# EAGLE design gl-gps (EAGLE 6.4)
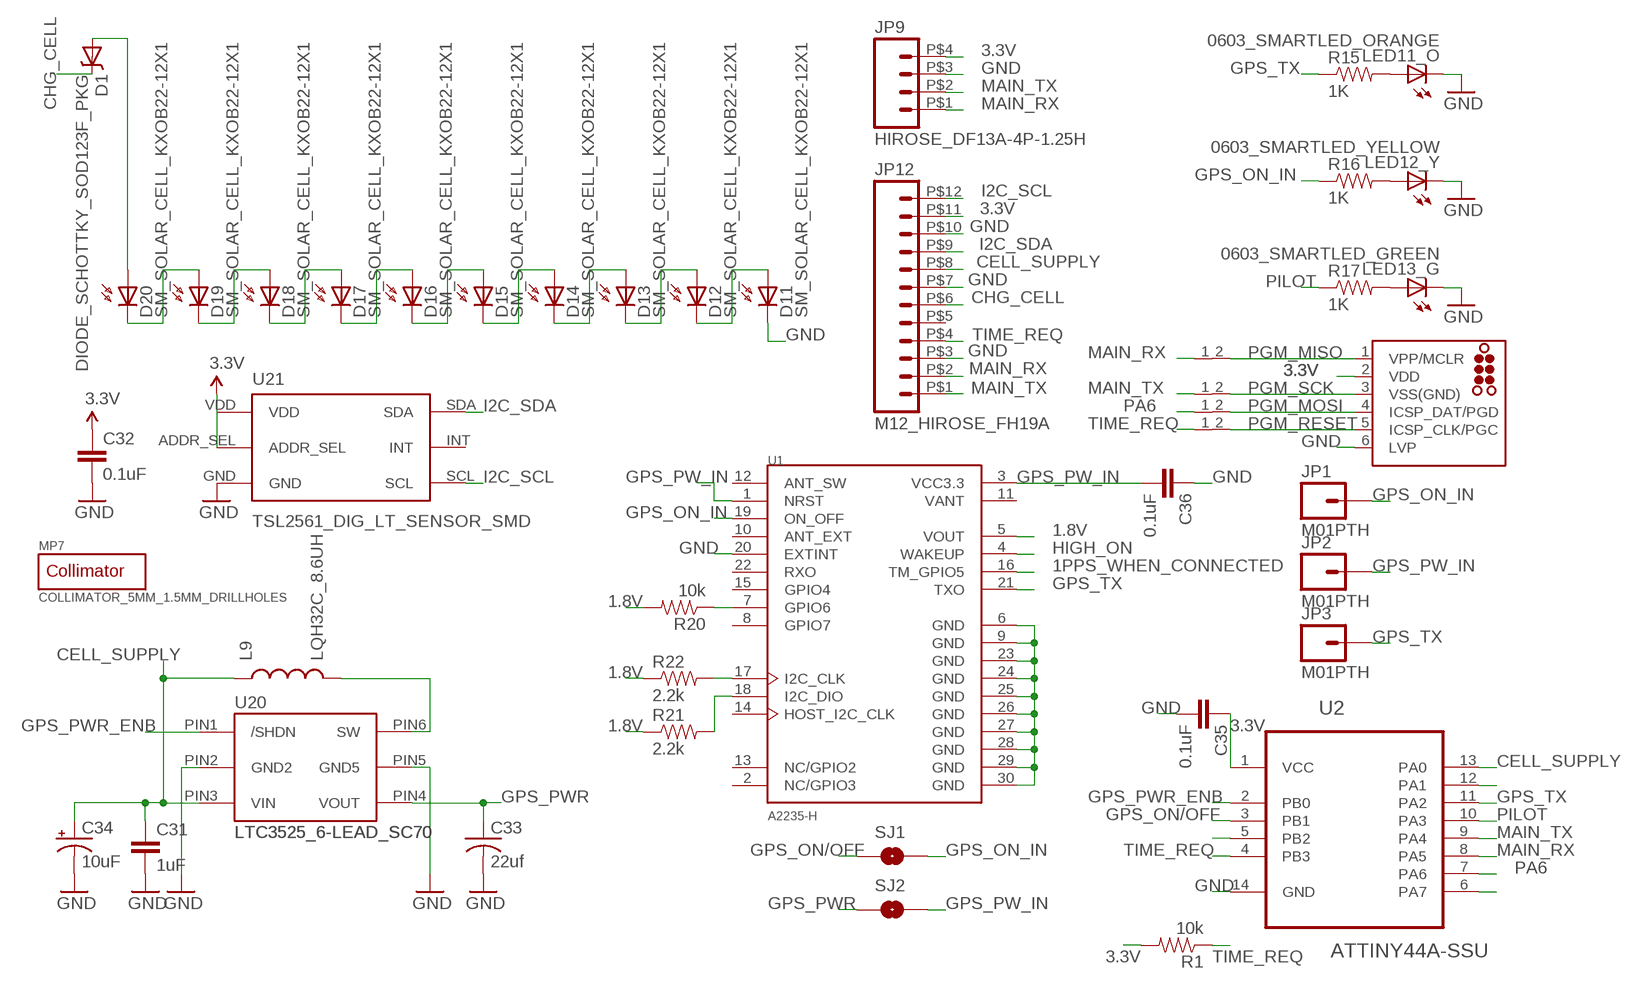
[diagram p0: schematic, sheet 1]

## Parts
C31  1uF  CAP0603-CAP  [0603-CAP]
C32  0.1uF  CAP0402-CAP  [0402-CAP]
C33  22uf  C-USC1210K  [C1210K]
C34  10uF  CAP_POL1206  [EIA3216]
C35  0.1uF  CAP0402-CAP  [0402-CAP]
C36  0.1uF  CAP0402-CAP  [0402-CAP]
D1  DIODE_SCHOTTKY_SOD123F_PKG  [SOD123F]
D11  SM_SOLAR_CELL_KXOB22-12X1  [SM_SOLAR_CELL_KXOB22-12X1]
D12  SM_SOLAR_CELL_KXOB22-12X1  [SM_SOLAR_CELL_KXOB22-12X1]
D13  SM_SOLAR_CELL_KXOB22-12X1  [SM_SOLAR_CELL_KXOB22-12X1]
D14  SM_SOLAR_CELL_KXOB22-12X1  [SM_SOLAR_CELL_KXOB22-12X1]
D15  SM_SOLAR_CELL_KXOB22-12X1  [SM_SOLAR_CELL_KXOB22-12X1]
D16  SM_SOLAR_CELL_KXOB22-12X1  [SM_SOLAR_CELL_KXOB22-12X1]
D17  SM_SOLAR_CELL_KXOB22-12X1  [SM_SOLAR_CELL_KXOB22-12X1]
D18  SM_SOLAR_CELL_KXOB22-12X1  [SM_SOLAR_CELL_KXOB22-12X1]
D19  SM_SOLAR_CELL_KXOB22-12X1  [SM_SOLAR_CELL_KXOB22-12X1]
D20  SM_SOLAR_CELL_KXOB22-12X1  [SM_SOLAR_CELL_KXOB22-12X1]
J1  TC2030-MCP-NL  [TC2030-MCP-NL]
JP1  M01PTH  [1X01]
JP2  M01PTH  [1X01]
JP3  M01PTH  [1X01]
JP9  HIROSE_DF13A-4P-1.25H  [HIROSE_DF13A-4P-1.25H]
JP12  M12_HIROSE_FH19A  [HIROSE_FH19_12POS]
L9  LQH32C_8.6UH  LQH32C  [1210_SIZE_INDUCTOR]
LED11_O  0603_SMARTLED_ORANGE  0603_SMARTLED  [0603_SMARTLED]
LED12_Y  0603_SMARTLED_YELLOW  0603_SMARTLED  [0603_SMARTLED]
LED13_G  0603_SMARTLED_GREEN  0603_SMARTLED  [0603_SMARTLED]
MP7  COLLIMATOR_5MM_1.5MM_DRILLHOLES  [COLLIMATOR_5MM_1.5MM_DRILLHOLES]
R1  10k  RESISTOR0402-RES  [0402-RES]
R15  1K  RESISTOR0402-RES  [0402-RES]
R16  1K  RESISTOR0402-RES  [0402-RES]
R17  1K  RESISTOR0402-RES  [0402-RES]
R20  10k  RESISTOR0402-RES  [0402-RES]
R21  2.2k  RESISTOR0402-RES  [0402-RES]
R22  2.2k  RESISTOR0402-RES  [0402-RES]
SJ1  SOLDERJUMPERTRACE  [SJ_2S-TRACE]
SJ2  SOLDERJUMPERTRACE  [SJ_2S-TRACE]
U1  A2235-H  [XCVR_A2235-H]
U2  ATTINY44A-SSU  [SOIC127P600X175-14N]
U20  LTC3525_6-LEAD_SC70  [SC70]
U21  TSL2561_DIG_LT_SENSOR_SMD  [6_PAD_FLAT_NO-LEAD]
U$2  SHORT_8MIL8MIL  [SHORT_8MIL]
U$3  SHORT_8MIL8MIL  [SHORT_8MIL]
U$4  SHORT_8MIL8MIL  [SHORT_8MIL]
U$5  SHORT_8MIL8MIL  [SHORT_8MIL]

## Nets
1.8V: R20.2 R21.1 R22.1 U1.5(VOUT)
1PPS_WHEN_CONNECTED: U1.16(TM_GPIO5)
3.3V: C32.1 C35.1 J1.2(VDD) JP9.P$4 JP12.P$11 R1.2 U2.1(VCC) U21.ADDR_SEL U21.VDD
CELL_SUPPLY: C31.1 C34.A(+) JP12.P$8 L9.P$1 U2.13(PA0) U20.PIN3(VIN)
CHG_CELL: D1.P$1(C) JP12.P$6
GND: C31.2 C32.2 C33.2 C34.C(-) C35.2 C36.1 D11.CATHODE(C) J1.6(LVP) JP9.P$3 JP12.P$3 JP12.P$7 JP12.P$10 LED11_O.P$1(C) LED12_Y.P$1(C) LED13_G.P$1(C) U1.6(GND) U1.9(GND) U1.20(EXTINT) U1.23(GND) U1.24(GND) U1.25(GND) U1.26(GND) U1.27(GND) U1.28(GND) U1.29(GND) U1.30(GND) U2.14(GND) U20.PIN2(GND2) U20.PIN5(GND5) U21.GND
GPS_ON/OFF: SJ1.1 U2.3(PB1)
GPS_ON_IN: JP1.1 R16.1 SJ1.2 U1.19(ON_OFF)
GPS_PW_IN: C36.2 JP2.1 SJ2.2 U1.1(NRST) U1.3(VCC3.3)
GPS_PWR: C33.1 SJ2.1 U20.PIN4(VOUT)
GPS_PWR_ENB: U2.2(PB0) U20.PIN1(/SHDN)
GPS_TX: JP3.1 R15.1 U1.21(TXO) U2.11(PA2)
HIGH_ON: U1.4(WAKEUP)
I2C_SCL: JP12.P$12 U21.SCL
I2C_SDA: JP12.P$9 U21.SDA
MAIN_RX: JP9.P$1 JP12.P$2 U2.8(PA5) U$2.1(P)
MAIN_TX: JP9.P$2 JP12.P$1 U2.9(PA4) U$3.1(P)
N$1: D19.ANODE(A) D20.CATHODE(C)
N$2: D17.ANODE(A) D18.CATHODE(C)
N$3: D15.ANODE(A) D16.CATHODE(C)
N$4: D1.P$2(A) D20.ANODE(A)
N$5: D18.ANODE(A) D19.CATHODE(C)
N$7: D16.ANODE(A) D17.CATHODE(C)
N$8: D14.ANODE(A) D15.CATHODE(C)
N$9: D12.ANODE(A) D13.CATHODE(C)
N$10: LED11_O.P$2(A) R15.2
N$11: D13.ANODE(A) D14.CATHODE(C)
N$12: L9.P$2 U20.PIN6(SW)
N$13: D11.ANODE(A) D12.CATHODE(C)
N$14: U2.5(PB2)
N$15: LED12_Y.P$2(A) R16.2
N$18: LED13_G.P$2(A) R17.2
N$21: U2.12(PA1)
N$23: R21.2 U1.18(I2C_DIO)
N$24: R22.2 U1.17(I2C_CLK)
N$25: R20.1 U1.7(GPIO6)
N$32: U2.6(PA7)
PA6: U2.7(PA6) U$4.1(P)
PGM_MISO: J1.1(VPP/MCLR) U$2.2(P)
PGM_MOSI: J1.4(ICSP_DAT/PGD) U$4.2(P)
PGM_RESET: J1.5(ICSP_CLK/PGC) U$5.2(P)
PGM_SCK: J1.3(VSS(GND)) U$3.2(P)
PILOT: R17.1 U2.10(PA3)
TIME_REQ: JP12.P$4 R1.1 U2.4(PB3) U$5.1(P)
Unconnected: JP12.P$5 U1.2(NC/GPIO3) U1.8(GPIO7) U1.10(ANT_EXT) U1.12(ANT_SW) U1.13(NC/GPIO2) U1.14(HOST_I2C_CLK) U1.15(GPIO4) U1.22(RXO) U21.INT

## Power pins joined to a net without a drawn wire
VANT: U1.11(VANT)

## Library data of the parts
C31 C32 C35 C36 = SparkFun:CAP: Capacitor Standard 0603 ceramic capacitor, and 0.1" leaded capacitor.
C33 = resistor:C-US: CAPACITOR, American symbol
C34 = SparkFun:CAP_POL: Capacitor Polarized These are standard SMD and PTH capacitors. Normally 10uF, 47uF, and 100uF in electrolytic and tantalum varieties. Always verify the external diameter of the through hole cap, it varies with capacity, voltage, and manufacturer. The EIA devices should be standard.
D1 = rshory:DIODE_SCHOTTKY
D11-D20 = rshory:SM_SOLAR_CELL_KXOB22-12X1: IXYS Corporation, part # KXOB22-12x1, surface mount solar cell. Nominal, ~0.5V, ~45mA.
J1 = tag-connect:TC2030: TAG-CONNECT ICSP Connector Manufacturer: Tag-Connect <http://www.tag-connect.com> Cable for easy In-Circuit Serial Programming. Designed for Microchip ICD2, suitable for many others. Two variants - one "with legs" (for hands-free fit on PCB) and another "without legs" for quick programming. PAD Description 1 MCLR/Vpp 2 Vdd 3 GND 4 PGD (ISPDAT) 5 PGC (ISPCLK) 6 nc (used for LVP) ©2009 ROFA.cz - modified and updated by Robert Darlington ‹rdarlington@gmail.com›
JP1-JP3 = SparkFun:M01: Header 1 Standard 1-pin 0.1" header. Use with straight break away headers (SKU : PRT-00116), right angle break away headers (PRT-00553), swiss pins (PRT-00743), machine pins (PRT-00117), and female headers (PRT-00115).
JP9 = rshory:HIROSE_DF13A-4P-1.25H: Hirose DF13A- 4P-1.25H pin header, 4 position, 90 degree, surface mount.
JP12 = rshoryV6:M12_HIROSE_FH19: Surface mount connector for flat flex cable (FFC), 12 position, 0.5mm pitch, Hirose FH19 series
L9 = rshory:LQH32C: LQH32C_53 Series chip inductor, smd 1210 size
LED11_O LED12_Y LED13_G = rshory:0603_SMARTLED: SmartLED, 0603 footprint, Osram. Diagonal silkscreen mark indicates cathode, matches cutout on case.
MP7 = rshory:COLLIMATOR_5MM_1.5MM_DRILLHOLES: Collimator, put over a photodetector to limit incoming light to a certain range of angle. Pieces to be laser-cut out of standard black acrylic sheet, 3/16" (~5mm) thickness. Center hole is 5mm diameter. Drill holes in the board are 1.5mm diameter, for screws to tap into. This is the best hole to take size 0-43 thread forming screws (McMaster part number 95893A119). LaserCuts layer (108) shows traces for laser cutting, about 0.25mm, 10mils kerf. So hole radii are half this much smaller, outside dimensions are half this much larger. Note that screw holes in the piece (nominal 1.8mm) are larger than the board holes. Screws go cleanly THROUGH the piece holes, but CUT INTO board holes. Approximate size of screw heads are on the tDocu layer.
R1 R15-R17 R20-R22 = SparkFun:RESISTOR: Resistor Basic schematic elements and footprints for 0603, 1206, and PTH resistors.
SJ1 SJ2 = SparkFun:SOLDERJUMPER: Solder Jumper Standard SMD solder jumper. Used to automate production. Two varients : Normally Open and Normally Closed are the same, but have different paste layers. NC will have a large amount of paste and should jumper during reflow.
U1 = A2235-H:A2235-H: Gps Module, Mini Outline w/ Ant
U2 = Atmel_By_element14_Batch_1-00:ATTINY44A-SSU: 8-bit Microcontroller with In-System Programmable Flash; MPN: ATTINY44A-SSU; OC_FARNELL: 1699397; OC_NEWARK: 80P3683; PACKAGE: SOIC-14; SUPPLIER: Atmel
U20 = rshoryV6:LTC3525: LTC2525 3.3v boost regulator 6-lead SC70 package
U21 = rshoryV6:TSL2561_DIG_LT_SENSOR: TAOS infrared and broadband digital light sensor, I2C interface
U$2-U$5 = rshoryV6:SHORT_8MIL

## Board
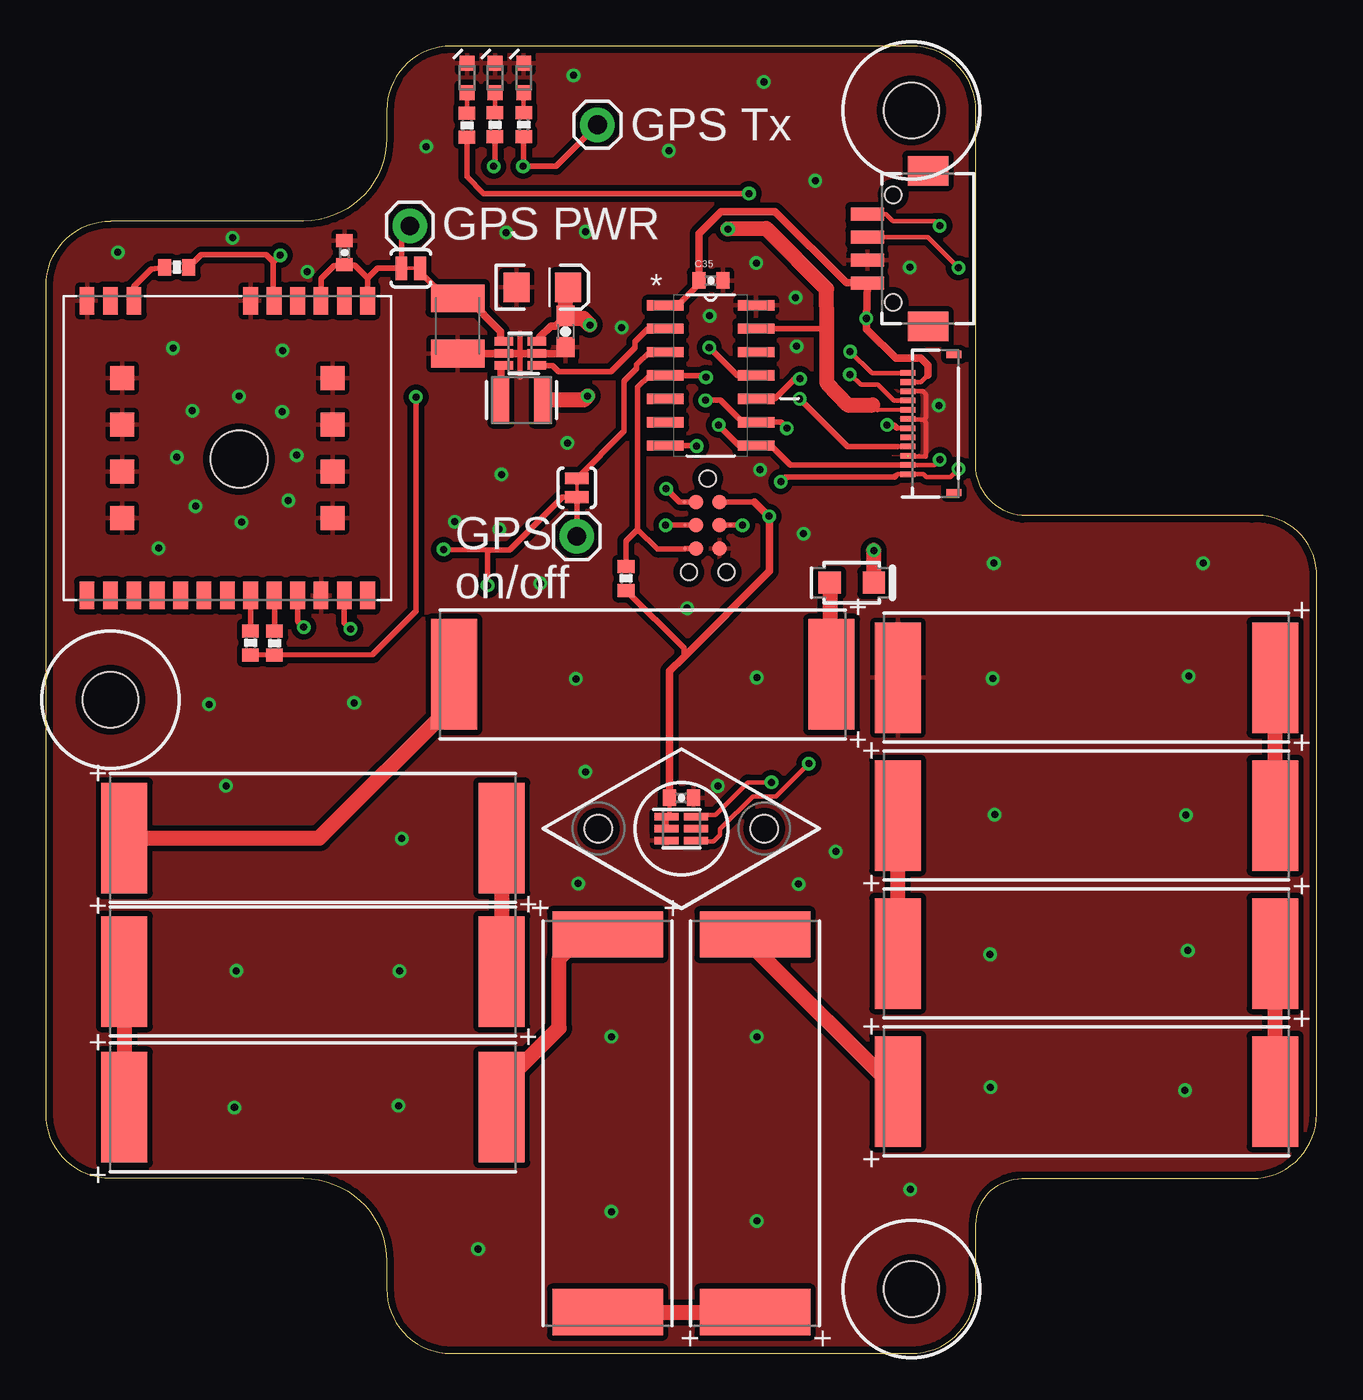
[diagram p1: board, top side]
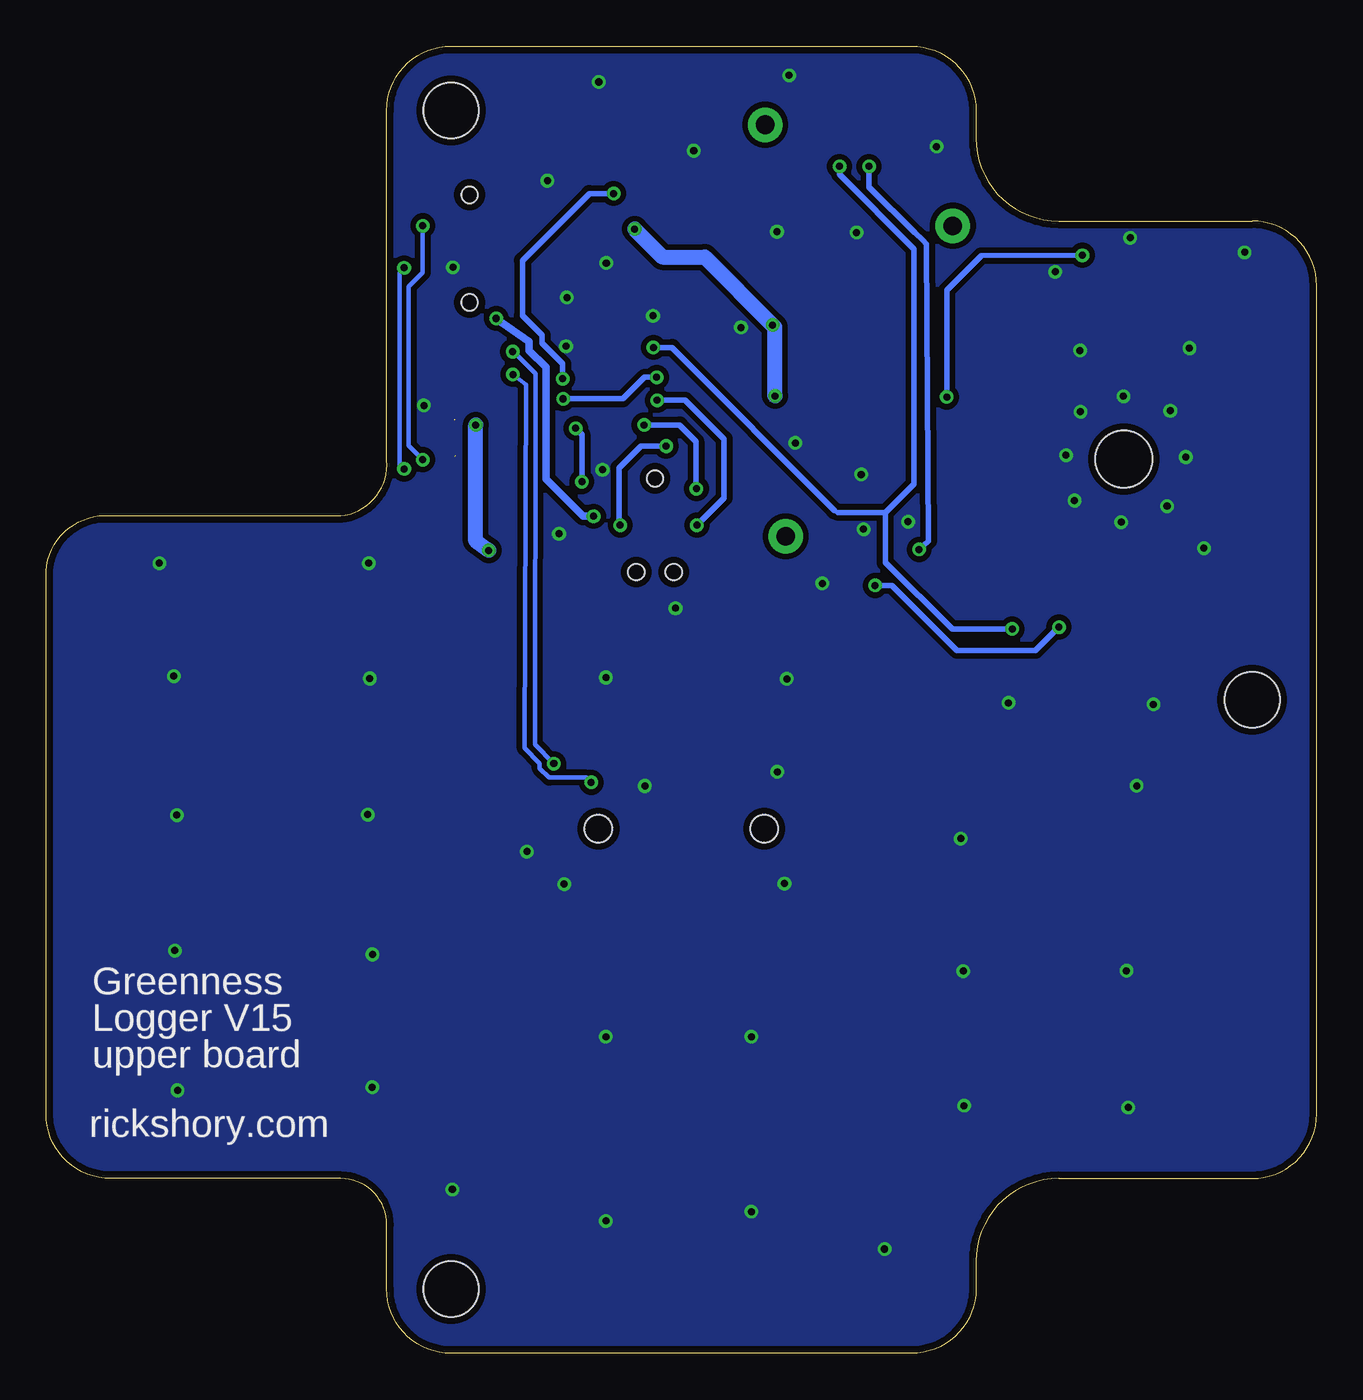
[diagram p2: board, bottom side, seen from below]

Size 69 x 71 mm. Coordinates in mm from the lower left corner, seen from the top.
Outline: 18.5,3.5 arc90 22,0 47,0 arc90 50.5,3.5 50.5,7 arc-90 53,9.5 65.5,9.5 arc90 69,13 69,42.5 arc90 65.5,45.5 53,45.5 arc-90 50.5,48.5 50.5,67.5 arc90 47,71 22,71 arc90 18.5,67.5 18.5,66 arc-90 14,61.5 3.5,61.5 arc90 0,58 0,13 arc90 3.5,9.5 14,9.5 arc-90 18.5,5 18.5,3.5
Copper layers (1*16): Top 0.0356mm / dielectric 1.5011mm / Bottom 0.0356mm
Design rules "default": minimum track width 6mil, minimum drill 13mil, track to track 6mil, track to pad 6mil, pad to pad 6mil, via to via 6mil, smd to smd 6mil, copper to edge 15mil, drill to drill 6mil, minimum pad ring 7mil, minimum via ring 7mil, stop-mask expansion 4mil, vias tented up to drill 16mil, thermal gap 10mil
Holes 3 mm at 47,3.5 47,67.5 3.5,35.5

### Footprints (pad centres in the part's own frame; a part is rotated, then mirrored left to right if it is on the bottom)
0603-CAP = smd 1.1 x 1: 1 -0.85,0; 2 0.85,0
0402-CAP = smd 0.7 x 0.9: 1 -0.65,0; 2 0.65,0
C1210K = smd 1.5 x 2.9: 1 -1.5,0; 2 1.5,0
EIA3216 = smd 1.4 x 1.6: A 1.4,0; C -1.4,0
SOD123F = smd 1.2 x 1.2: P$1 -1.2,0; P$2 1.2,0
SM_SOLAR_CELL_KXOB22-12X1 = smd 2.5 x 6: ANODE -10.25,0; CATHODE 10.25,0
TC2030-MCP-NL = smd 0.787 x 0.787: 1 1.27,-0.635; 2 1.27,0.635; 3 2.54,-0.635; 4 2.54,0.635; 5 3.81,-0.635; 6 3.81,0.635 | hole 0.889: 0,0; 5.08,-1.016; 5.08,1.016
1X01 = drill 1.016 pad 1.88: 1 0,0
HIROSE_DF13A-4P-1.25H = smd 0.7 x 1.8: P$1 -1.875,-3.3; P$2 -0.625,-3.3; P$3 0.625,-3.3; P$4 1.875,-3.3 | smd 1.6 x 2.2: P$5 4.225,0; P$6 -4.225,0 | hole 0.9: -2.925,-1.9; 2.925,-1.9
HIROSE_FH19_12POS = smd 0.3 x 0.8: P$1 -2.75,1.2; P$2 -2.25,1.2; P$3 -1.75,1.2; P$4 -1.25,1.2; P$5 -0.75,1.2; P$6 -0.25,1.2; P$7 0.25,1.2; P$8 0.75,1.2; P$9 1.25,1.2; P$10 1.75,1.2; P$11 2.25,1.2; P$12 2.75,1.2 | smd 0.4 x 0.8: P$13 3.75,-1.3; P$14 -3.75,-1.3
1210_SIZE_INDUCTOR = smd 0.9 x 2.5: P$1 -1.125,0; P$2 1.125,0
0603_SMARTLED = smd 0.8 x 0.8: P$1 -0.8,0; P$2 0.8,0
COLLIMATOR_5MM_1.5MM_DRILLHOLES = hole 1.5: -4.5,0; 4.5,0
0402-RES = smd 0.7 x 0.9: 1 -0.65,0; 2 0.65,0
SJ_2S-TRACE = smd 0.635 x 1.27: 1 -0.508,0; 2 0.508,0
XCVR_A2235-H = smd 1.5 x 0.8: 1 -8,7.62; 2 -8,6.35; 3 -8,5.08; 4 -8,3.81; 5 -8,2.54; 6 -8,1.27; 7 -8,-5.08; 8 -8,-6.35; 9 -8,-7.62; 10 8,-7.62; 11 8,-6.35; 12 8,-5.08; 13 8,-3.81; 14 8,-2.54; 15 8,-1.27; 16 8,0; 17 8,1.27; 18 8,2.54; 19 8,3.81; 20 8,5.08; 21 8,6.35; 22 8,7.62 | smd 1.3 x 1.3: 23 -3.81,5.715; 24 -1.27,5.715; 25 1.27,5.715; 26 3.81,5.715; 27 -3.81,-5.715; 28 -1.27,-5.715; 29 1.27,-5.715; 30 3.81,-5.715 | hole 3.1: 0.605,0.63
SOIC127P600X175-14N = smd 1.981 x 0.559: 1 -2.464,3.81; 2 -2.464,2.54; 3 -2.464,1.27; 4 -2.464,0; 5 -2.464,-1.27; 6 -2.464,-2.54; 7 -2.464,-3.81; 8 2.464,-3.81; 9 2.464,-2.54; 10 2.464,-1.27; 11 2.464,0; 12 2.464,1.27; 13 2.464,2.54; 14 2.464,3.81
SC70 = smd 1 x 0.46: PIN1 -0.9,0.65; PIN2 -0.9,0; PIN3 -0.9,-0.65; PIN4 0.9,-0.65; PIN5 0.9,0; PIN6 0.9,0.65
6_PAD_FLAT_NO-LEAD = smd 1.3 x 0.4: ADDR_SEL -0.8,0; GND -0.8,-0.65; INT 0.8,0; SCL 0.8,-0.65; SDA 0.8,0.65; VDD -0.8,0.65
SHORT_8MIL = smd 0.203 x 0.203: 1 0,0; 2 0,0

### Placement (x,y rotation side)
C31  28.21,55.5 270 top
C32  34.5,30.17 0 top
C33  22.35,55.8 270 top
C34  26.95,57.9 0 top
C35  36.1,58.26 0 top
C36  16.21,59.78 270 top
D1  43.76,41.86 180 top
D11  56.5,36.71 180 top
D12  56.5,29.21 0 top
D13  56.5,21.72 180 top
D14  56.5,14.23 0 top
D15  38.5,12.5 90 top
D16  30.5,12.5 270 top
D17  14.5,13.37 0 top
D18  14.5,20.74 180 top
D19  14.5,27.99 0 top
D20  32.4,36.88 180 top
J1  35.93,47.51 270 top
JP1  28.83,44.37 0 top
JP2  19.76,61.24 0 top
JP3  29.95,66.72 0 top
JP9  47.9,60 270 top
JP12  48,50.5 90 top
L9  25.82,51.77 180 top
LED11_O  25.94,69.26 270 top
LED12_Y  24.38,69.26 270 top
LED13_G  22.86,69.26 270 top
MP7  34.5,28.5 0 top
R1  31.49,42.09 270 top
R15  25.94,66.73 90 top
R16  24.38,66.72 90 top
R17  22.86,66.7 90 top
R20  7.1,58.98 0 top
R21  12.41,38.58 90 top
R22  11.11,38.59 90 top
SJ1  28.83,47.01 270 top
SJ2  19.81,58.93 180 top
U1  9.85,49.17 270 top
U2  36.09,53.11 0 top
U20  25.75,54.3 180 top
U21  34.5,28.5 0 top
U$2  34.68,46.24 0 top
U$3  34.69,44.97 0 top
U$4  37.17,44.97 0 top
U$5  34.69,43.7 0 top

### Tracks (layer width: path | path; a pad name or v marks a point on that pad's centre or on a via)
1.8V  (via drill 0.38)
  Top 0.305: U1.5 12.34,57.21 12.34,59.26 | R22.1 12.4,37.96 R21.1 17.74,37.95 20.09,40.31 v20.09,51.94 | 12.34,59.26 v12.72,59.64 | R20.2 8.43,59.66 11.96,59.66 12.34,59.28 12.34,59.26
  Bottom 0.305: v20.09,51.94 20.09,57.73 18.21,59.61 v12.72,59.64
3.3V  (via drill 0.38)
  Top 0.254: C32.1 33.85,29.3 U21.VDD U21.ADDR_SEL | JP12.P$11 47.52,52.75 47.9,53.13
  Top 0.305: C35.1 35.45,58.06 34.31,56.92 U2.1 | 44.46,58.26 JP9.P$4 | J1.2 38.46,46.24 | R1.2 34.63,38.3 34.63,37.83
  Top 0.406: 47.9,53.13 47.9,53.67 47.52,54.05 46.15,54.05 44.63,55.55 44.55,55.63 v44.55,56.21 JP9.P$4 44.59,58.14 43.46,58.14 39.6,62 36.65,62 35.45,60.8 C35.1 | 38.46,46.24 39.29,45.41 | 39.29,45.41 39.29,42.49 34.63,37.83 33.85,37.05 C32.1 | 39.29,45.41 v39.27,45.47
  Bottom 0.406: v44.55,56.21 42.77,54.94 42.77,54.46 41.86,53.57 41.86,47.47 39.85,45.47 v39.27,45.47
CELL_SUPPLY  (via drill 0.38)
  Top 0.254: L9.P$1 27.02,51.7 | 44.88,51.51 45.15,51.23 JP12.P$8 | U20.PIN3 26.65,55.04 26.8,55.19
  Top 0.305: U2.13 42.2,55.65 42.4,55.85
  Top 0.406: 26.8,55.19 27.41,55.8 27.66,55.8 C31.1
  Top 0.813: C34.A 28.21,57.9 C31.1 28.36,56.2 29.19,56.2 v29.54,55.85 | L9.P$1 29.19,51.77 v29.41,51.99 | 44.88,51.51 43.53,51.51 42.42,52.68 42.4,55.85 42.39,57.81 39.12,61.09 v37.03,61.06
  Bottom 0.813: v37.03,61.06 35.53,59.54 33.22,59.54 v29.54,55.85 29.44,55.75 29.44,52.02 v29.41,51.99
CHG_CELL  (via drill 0.38)
  Top 0.254: JP12.P$6 46.21,50.25
  Top 0.305: v45.67,50.42 46.04,50.42 46.21,50.25
  Top 0.813: D1.P$1 v44.95,43.61 v44.96,43.61
  Bottom 0.813: v44.96,43.61 45.67,44.12 v45.67,50.42
GND  (via drill 0.38)  (2 unrouted)
  Top 0.254: 47.7,50.72 46.81,50.72 | 46.81,48.72 47.78,48.72 47.78,50.57 47.7,50.65 47.7,50.72 | JP12.P$10 47.62,52.25 47.78,52.09 47.78,50.8 47.7,50.72
  Top 0.305: 25.75,55.4 25.75,53.01
  Top 0.406: C31.2 27.86,54.3 U20.PIN2 U20.PIN5 | U20.PIN5 22.38,54.3 U20.PIN5
  other vias: 62.84,42.91 40.87,25.49 46.94,8.9 10.33,20.78 29.29,31.58 23.46,5.67 38.6,36.71 51.42,36.65 62.06,36.78 61.9,29.24 51.52,29.26 51.27,21.67 51.29,14.46 38.6,17.2 30.7,17.2 30.7,7.7 28.9,25.52 42.89,27.25 10.23,13.36 19.14,13.46 38.6,7.2 51.47,42.92 62.01,21.88 28.77,36.64 48.47,51.48 36.48,30.82 46.9,58.99 26.84,41.82 24.61,44.77 22.19,45.17 24.73,47.74 24.99,60.87 29.3,60.92 10.48,51.98 10.61,45.15 13.15,46.32 12.82,51.14 7.11,48.68 7.94,51.19 8.12,46.01 13.61,48.78 3.91,59.8 20.64,65.54 10.13,60.59 14.19,58.74 28.64,69.4 33.83,65.31 38.98,69.05 41.78,63.69 40.76,54.7 38.58,59.22 19.2,20.77 19.32,27.96 9.77,30.83 8.86,35.25 61.85,14.29 31.26,55.71 28.31,49.44 38.78,47.99 36.04,56.35 41.14,44.51 6.9,54.6 12.85,54.47 6.11,43.73 16.73,35.33 34.82,40.47 40.71,57.34
  pour Top (isolate 0.305, rank 2): -0.48,71.65 25.5,71.65 25.5,71.5 69.87,71.65 69.87,-0.23 41.93,-0.48 -0.48,-0.48
  pour Bottom (isolate 0.305, rank 2): -0.48,71.65 25.5,71.65 25.5,71.5 69.62,71.65 69.62,-0.48 41.93,-0.48 -0.48,-0.23
GPS_ON/OFF
  Top 0.305: U2.3 32.77,54.38 32.08,53.69 32.08,53.49 31.39,52.8 31.39,50.09 SJ1.1
GPS_ON_IN  (via drill 0.38)
  Top 0.305: v13.99,39.45 13.66,39.78 U1.19 | v23.98,41.7 23.98,43.58 23.92,43.64 | R16.1 24.38,64.54 v24.31,64.46 | v21.59,43.66 23.92,43.64 | 25.2,43.69 25.2,43.66 | 25.2,43.66 25.17,43.66 25.17,43.64 23.92,43.64 | 25.2,43.66 28.04,46.51 SJ1.2 JP1.1
  Bottom 0.305: v13.99,39.45 15.26,38.17 19.53,38.17 23.06,41.7 v23.98,41.7 | 24.2,64.46 v24.31,64.46 24.31,63.35 21.82,60.86 21.39,60.45 21.18,60.25 21.18,60.12 21.08,44.12 v21.59,43.66
GPS_PW_IN
  Top 0.305: U1.1 17.47,58.4 | U1.3 14.93,58.36 15.64,59.08 16.16,59.08 C36.2 16.23,59.1 16.76,59.1 17.47,58.4 | 17.47,58.4 18,58.93 SJ2.2 19.3,60.78 JP2.1
GPS_PWR
  Top 0.254: U20.PIN4 24.85,54.98 24.69,55.14
  Top 0.305: 21.74,57.3 20.32,58.72 SJ2.1
  Top 0.406: C33.1 22.88,57.3 24.69,55.49 24.69,55.14 24.69,54.96
  Top 0.813: C33.1 21.74,57.3
GPS_PWR_ENB
  Top 0.305: U20.PIN1 27.5,53.65 27.84,53.31 30.68,53.31 31.98,54.61 31.98,54.94 32.69,55.65 U2.2
GPS_TX  (via drill 0.38)
  Top 0.305: U2.11 37.54,53.11 v36.02,54.63 | U1.21 16.2,39.68 v16.53,39.34 | R15.1 25.94,64.5 v25.91,64.46 27.68,64.46 JP3.1
  Bottom 0.305: v36.02,54.63 35,54.63 26.19,45.77 25.98,45.67 23.42,45.67 | v16.53,39.34 19.79,39.34 23.42,42.95 23.42,45.67 | v25.91,64.46 25.91,64.03 21.87,59.97 21.87,47.22 23.42,45.67
I2C_SCL  (via drill 0.38)
  Top 0.254: v41.43,32.03 39.65,30.25 38.38,30.25 36.6,28.47 36.6,28.17 36.24,27.81 35.34,27.81 U21.SCL | JP12.P$12 44.84,53.23 v43.66,54.41
  Bottom 0.254: v43.66,54.41 43.61,54.41 42.42,53.21 42.44,33.07 v41.43,32.03
I2C_SDA  (via drill 0.38)
  Top 0.254: v43.65,53.17 43.68,53.17 44.24,52.6 45.19,52.6 46.03,51.75 JP12.P$9 | v39.39,31.01 38.12,31.01 36.35,29.23 35.38,29.23 U21.SDA
  Bottom 0.254: v43.65,53.17 42.93,52.6 43.01,32.87 42.19,32.03 42.19,31.77 41.68,31.27 39.65,31.27 v39.39,31.01
MAIN_RX  (via drill 0.38)
  Top 0.254: JP9.P$1 45.62,61.88 46,61.49 48.28,61.49 v48.54,61.24 | JP12.P$2 48.25,48.25 v48.54,48.54
  Top 0.305: v36.52,50.42 37.64,49.3 U2.8 38.61,49.25 39.42,49.25 40.42,48.25 JP12.P$2 | v33.68,46.96 34.4,46.24 U$2.1
  Bottom 0.254: v48.54,61.24 48.54,58.7 49.3,57.94 49.3,49.3 v48.54,48.54
  Bottom 0.305: v36.52,50.42 34.59,50.42 33.7,49.53 33.7,46.99 v33.68,46.96
MAIN_TX  (via drill 0.38)
  Top 0.254: JP9.P$2 47.88,60.62 v49.55,58.95 | 49.3,47.78 arc90 v49.55,48.03 49.12,47.6 47.8,47.6 47.65,47.75 JP12.P$1 46.23,47.75 46.15,47.67
  Top 0.305: v35.81,51.76 36.62,51.76 37.82,50.57 U2.9 39.9,50.57 v40.23,50.24 | v33.65,44.98 33.66,44.97 U$3.1 | 46.15,47.67 46.07,47.6 40.16,47.6 v39.9,47.34
  Bottom 0.254: v49.55,58.95 49.81,58.7 49.81,48.28 arc-90 v49.55,48.03
  Bottom 0.305: v35.81,51.76 34.29,51.76 32.18,49.66 32.18,46.45 v33.65,44.98 | v40.23,50.24 39.9,49.91 v39.9,47.34
N$1
  Top 0.813: D19.ANODE 14.83,27.99 22.15,35.3 D20.CATHODE
N$2
  Top 0.813: D18.CATHODE D17.ANODE
N$3
  Top 0.813: D16.CATHODE D15.ANODE
N$4
  Top 0.813: D1.P$2 42.54,36.99 D20.ANODE
N$5
  Top 0.813: D19.CATHODE D18.ANODE
N$7
  Top 0.813: D17.CATHODE 24.75,14.56 27.86,17.68 27.86,21.46 29.13,22.73 30.48,22.73 D16.ANODE
N$8
  Top 0.813: D15.CATHODE 38.5,21.98 D14.ANODE
N$9
  Top 0.813: D13.CATHODE D12.ANODE
N$10
  Top 0.254: LED11_O.P$2 R15.2
N$11
  Top 0.813: D14.CATHODE D13.ANODE
N$12
  Top 0.406: L9.P$2 24.7,53.5 U20.PIN6
N$13
  Top 0.813: D12.CATHODE D11.ANODE
N$15
  Top 0.254: LED12_Y.P$2 R16.2
N$18
  Top 0.254: LED13_G.P$2 R17.2
N$23
  Top 0.305: R21.2 12.41,41.15 U1.18
N$24
  Top 0.305: R22.2 U1.17
N$25
  Top 0.305: R20.1 5.72,58.88 4.77,57.94 U1.7
PA6  (via drill 0.38)
  Top 0.305: U2.7 35.3,49.3 v35.33,49.27 | v37.82,44.98 37.17,44.98 U$4.1
  Bottom 0.305: v35.33,49.27 36.7,49.27 37.9,48.08 37.9,45.06 v37.82,44.98
PGM_MISO
  Top 0.305: J1.1 U$2.2
PGM_MOSI
  Top 0.305: J1.4 U$4.2 | U$4.2
PGM_RESET
  Top 0.305: J1.5 U$5.2 | U$5.2
PGM_SCK
  Top 0.305: J1.3 U$3.2 | U$3.2
PILOT  (via drill 0.38)
  Top 0.305: U2.10 39.57,51.84 40.66,52.93 v40.94,52.93 | v38.17,62.99 23.77,62.99 22.86,63.91 R17.1
  Bottom 0.305: v38.17,62.99 39.5,62.99 43.13,59.36 43.13,56.36 42.06,55.29 42.06,54.86 40.94,53.74 v40.94,52.93
TIME_REQ  (via drill 0.38)
  Top 0.254: JP12.P$4 46.23,49.25
  Top 0.305: 32.13,44.75 32.13,52.48 32.77,53.11 U2.4 35.74,53.11 v35.84,53.01 | 32.13,44.75 33.2,43.69 34.67,43.69 U$5.1 | 46.23,49.25 43.51,49.25 v40.92,51.84 | R1.1 31.49,44.12 32.13,44.75
  Bottom 0.305: v40.92,51.84 37.67,51.84 36.5,53.01 v35.84,53.01

### Text on the board
bPlace: Greenness | Logger V15 | upper board | rickshory.com
_tsilk: GPS Tx | GPS PWR | GPS / on/off